# Altium schematic sheet driveII.SchDoc
size A3
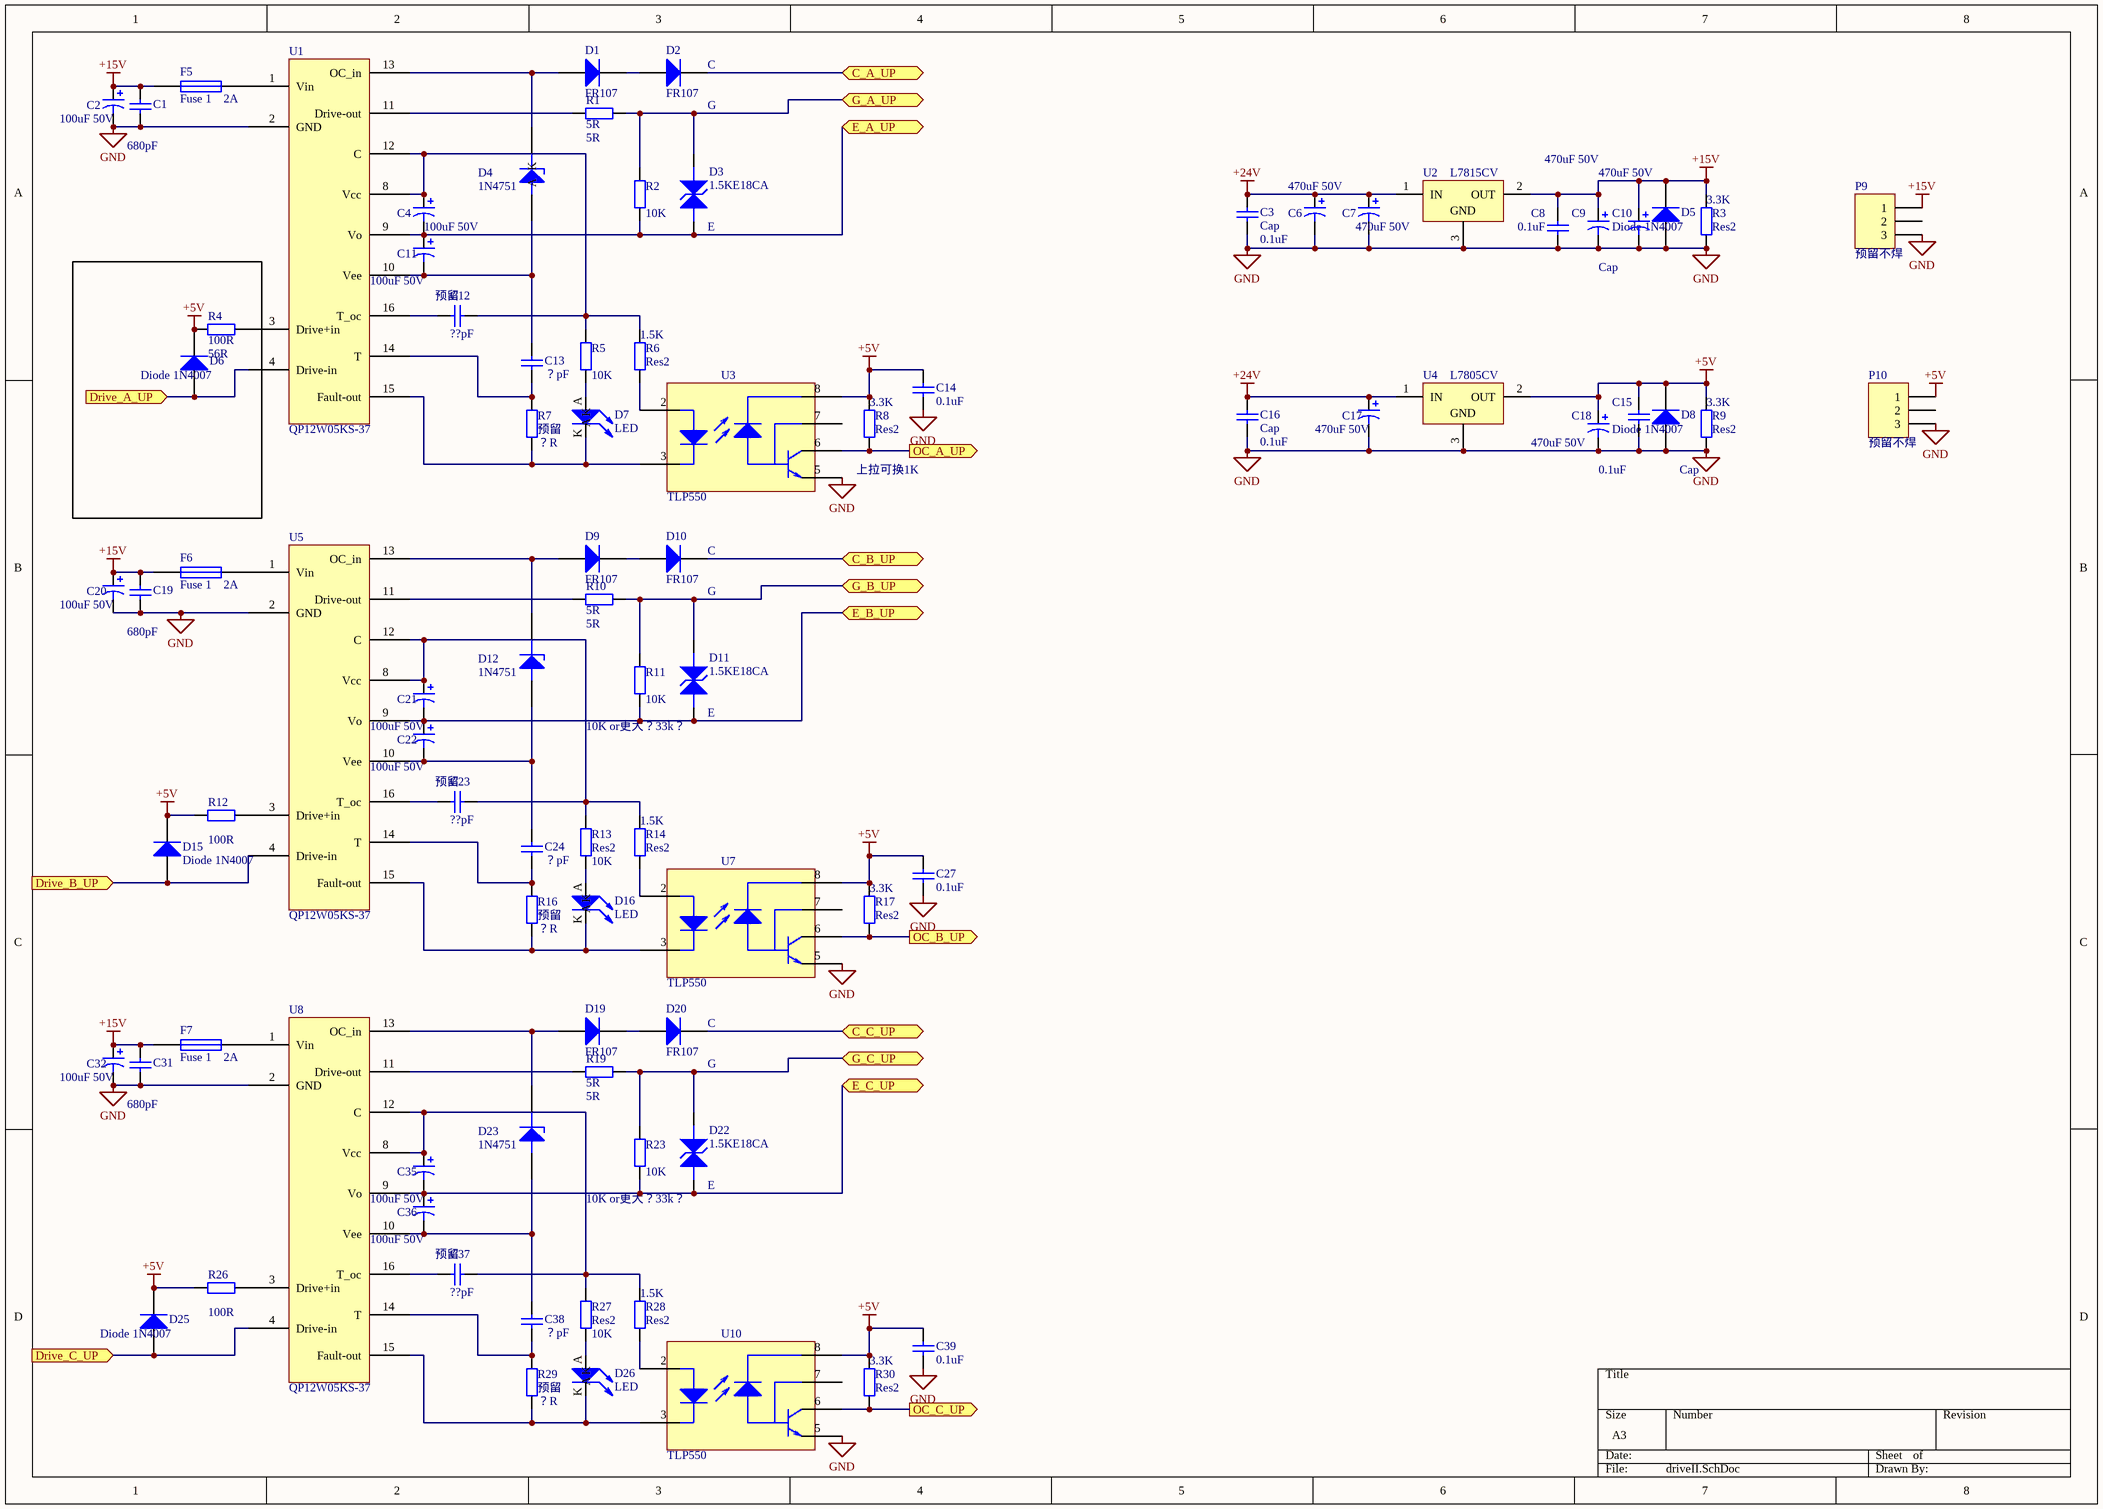
[diagram p0: driveII.SchDoc]

## Parts
C1  value 680pF  [1206]  (hidden comment: Cap)
C2  value 100uF 50V  [电解电容1000uF]  (hidden comment: Cap Pol1)
C3  Cap  value 0.1uF  [1206]
C4  value 100uF 50V  [电解电容1000uF]  (hidden comment: Cap Pol1)
C6  value 470uF 50V  [电解电容470uf]  (hidden comment: Cap Pol1)
C7  value 470uF 50V  [电解电容470uf]  (hidden comment: Cap Pol1)
C8  Cap  value 0.1uF  [1206]
C9  value 470uF 50V  [电解电容470uf]  (hidden comment: Cap Pol1)
C10  value 470uF 50V  [电解电容470uf]  (hidden comment: Cap Pol1)
C11  value 100uF 50V  [电解电容1000uF]  (hidden comment: Cap Pol1)
C12  预留  value ??pF  [1206]
C13  value ？pF  [1206]  (hidden comment: 预留)
C14  value 0.1uF  [1206]  (hidden comment: Cap)
C15  Cap  value 0.1uF  [1206]
C16  Cap  value 0.1uF  [1206]
C17  value 470uF 50V  [电解电容470uf]  (hidden comment: Cap Pol1)
C18  value 470uF 50V  [电解电容470uf]  (hidden comment: Cap Pol1)
C19  value 680pF  [1206]  (hidden comment: Cap)
C20  value 100uF 50V  [电解电容1000uF]  (hidden comment: Cap Pol1)
C21  value 100uF 50V  [电解电容1000uF]  (hidden comment: Cap Pol1)
C22  value 100uF 50V  [电解电容1000uF]  (hidden comment: Cap Pol1)
C23  预留  value ??pF  [1206]
C24  value ？pF  [1206]  (hidden comment: 预留)
C27  value 0.1uF  [1206]  (hidden comment: Cap)
C31  value 680pF  [1206]  (hidden comment: Cap)
C32  value 100uF 50V  [电解电容1000uF]  (hidden comment: Cap Pol1)
C35  value 100uF 50V  [电解电容1000uF]  (hidden comment: Cap Pol1)
C36  value 100uF 50V  [电解电容1000uF]  (hidden comment: Cap Pol1)
C37  预留  value ??pF  [1206]
C38  value ？pF  [1206]  (hidden comment: 预留)
C39  value 0.1uF  [1206]  (hidden comment: Cap)
D1  FR107  [DIODE-0.4]
D2  FR107  [DIODE-0.4]
D3  1.5KE18CA  [AXIAL0.4]
D4  1N4751  [DIODE0.4]
D5  Diode 1N4007  [DIODE0.4]
D6  Diode 1N4007  [DIODE-0.4]
D7  LED  [0805D]
D8  Diode 1N4007  [DIODE0.4]
D9  FR107  [DIODE-0.4]
D10  FR107  [DIODE-0.4]
D11  1.5KE18CA  [AXIAL0.4]
D12  1N4751  [DIODE0.4]
D15  Diode 1N4007  [DIODE-0.4]
D16  LED  [0805D]
D19  FR107  [DIODE-0.4]
D20  FR107  [DIODE-0.4]
D22  1.5KE18CA  [AXIAL0.4]
D23  1N4751  [DIODE0.4]
D25  Diode 1N4007  [DIODE-0.4]
D26  LED  [0805D]
F5  Fuse 1　2A  [CAPR5-4X5]
F6  Fuse 1　2A  [CAPR5-4X5]
F7  Fuse 1　2A  [CAPR5-4X5]
P9  预留不焊  [PHENOX-3]
P10  预留不焊  [PHENOX-3]
R1  5R  [AXIAL0.6]
R2  10K  [AXIAL0.4]
R3  Res2  value 3.3K  [AXIAL0.4]
R4  100R  value 56R  [AXIAL-0.6]
R5  value 10K  [1206]  (hidden comment: Res2)
R6  Res2  value 1.5K  [1206]
R7  预留  value ？R  [1206]
R8  Res2  value 3.3K  [1206]
R9  Res2  value 3.3K  [AXIAL0.4]
R10  5R  [AXIAL0.6]
R11  10K or更大？33k？  value 10K  [AXIAL0.4]
R12  value 100R  [AXIAL-0.6]  (hidden comment: Res2)
R13  Res2  value 10K  [1206]
R14  Res2  value 1.5K  [1206]
R16  预留  value ？R  [1206]
R17  Res2  value 3.3K  [1206]
R19  5R  [AXIAL0.6]
R23  10K or更大？33k？  value 10K  [AXIAL0.4]
R26  value 100R  [AXIAL-0.6]  (hidden comment: Res2)
R27  Res2  value 10K  [1206]
R28  Res2  value 1.5K  [1206]
R29  预留  value ？R  [1206]
R30  Res2  value 3.3K  [1206]
U1  QP12W05KS-37  [QP12W05KS37]
U2  L7815CV  [TO220ABN]
U3  TLP550  [DIP8]
U4  L7805CV  [TO220ABN]
U5  QP12W05KS-37  [QP12W05KS37]
U7  TLP550  [DIP8]
U8  QP12W05KS-37  [QP12W05KS37]
U10  TLP550  [DIP8]

## Ports
C_A_UP, C_B_UP, C_C_UP, Drive_A_UP (in), Drive_B_UP (in), Drive_C_UP (in), E_A_UP, E_B_UP, E_C_UP, G_A_UP, G_B_UP, G_C_UP, OC_A_UP (out), OC_B_UP (out), OC_C_UP (out)

## Nets
+5V: C14.1 C15.2 C18.1 C27.1 C39.1 D6.2(K) D8.K D15.2(K) D25.2(K) P10.1 R4.2 R8.2 R9.2 R12.2 R17.2 R26.2 R30.2 U3.8 U4.2(OUT) U7.8 U10.8
+15V: C1.2 C2.1 C8.2 C9.1 C10.1 C19.2 C20.1 C31.2 C32.1 D5.K F5.1 F6.1 F7.1 P9.1 R3.2 U2.2(OUT)
+24V: C3.2 C6.1 C7.1 C16.2 C17.1 U2.1(IN) U4.1(IN)
GND: C1.1 C2.2 C3.1 C6.2 C7.2 C8.1 C9.2 C10.2 C14.2 C15.1 C16.1 C17.2 C18.2 C19.1 C20.2 C27.2 C31.1 C32.2 C39.2 D5.A D8.A P9.3 P10.3 R3.1 R9.1 U1.2(GND) U2.3(GND) U3.5 U4.3(GND) U5.2(GND) U7.5 U8.2(GND) U10.5
C_A_UP: D2.2(K) ; port C_A_UP
C_B_UP: D10.2(K) ; port C_B_UP
C_C_UP: D20.2(K) ; port C_C_UP
Drive_A_UP: D6.1(A) U1.4(Drive-in) ; port Drive_A_UP
Drive_B_UP: D15.1(A) U5.4(Drive-in) ; port Drive_B_UP
Drive_C_UP: D25.1(A) U8.4(Drive-in) ; port Drive_C_UP
E_A_UP: C4.2 C11.1 D3.1 R2.1 U1.9(Vo) ; port E_A_UP
E_B_UP: C21.2 C22.1 D11.1 R11.1 U5.9(Vo) ; port E_B_UP
E_C_UP: C35.2 C36.1 D22.1 R23.1 U8.9(Vo) ; port E_C_UP
G_A_UP: D3.2 R1.2 R2.2 ; port G_A_UP
G_B_UP: D11.2 R10.2 R11.2 ; port G_B_UP
G_C_UP: D22.2 R19.2 R23.2 ; port G_C_UP
OC_A_UP: R8.1 U3.6 ; port OC_A_UP
OC_B_UP: R17.1 U7.6 ; port OC_B_UP
OC_C_UP: R30.1 U10.6 ; port OC_C_UP
NetC4_1: C4.1 C12.1 R5.2 R6.2 U1.8(Vcc) U1.12(C)
NetC11_2: C11.2 C13.1 D4.A U1.10(Vee)
NetC12_2: C12.2 U1.16(T_oc)
NetC13_2: C13.2 R7.2 U1.14(T)
NetC21_1: C21.1 C23.1 R13.2 R14.2 U5.8(Vcc) U5.12(C)
NetC22_2: C22.2 C24.1 D12.A U5.10(Vee)
NetC23_2: C23.2 U5.16(T_oc)
NetC24_2: C24.2 R16.2 U5.14(T)
NetC35_1: C35.1 C37.1 R27.2 R28.2 U8.8(Vcc) U8.12(C)
NetC36_2: C36.2 C38.1 D23.A U8.10(Vee)
NetC37_2: C37.2 U8.16(T_oc)
NetC38_2: C38.2 R29.2 U8.14(T)
NetD1_1: D1.1(A) D4.K U1.13(OC_in)
NetD1_2: D1.2(K) D2.1(A)
NetD7_A: D7.A R5.1
NetD7_K: D7.K R7.1 U1.15(Fault-out) U3.3
NetD9_1: D9.1(A) D12.K U5.13(OC_in)
NetD9_2: D9.2(K) D10.1(A)
NetD16_A: D16.A R13.1
NetD16_K: D16.K R16.1 U5.15(Fault-out) U7.3
NetD19_1: D19.1(A) D23.K U8.13(OC_in)
NetD19_2: D19.2(K) D20.1(A)
NetD26_A: D26.A R27.1
NetD26_K: D26.K R29.1 U8.15(Fault-out) U10.3
NetF5_2: F5.2 U1.1(Vin)
NetF6_2: F6.2 U5.1(Vin)
NetF7_2: F7.2 U8.1(Vin)
NetR1_1: R1.1 U1.11(Drive-out)
NetR4_1: R4.1 U1.3(Drive+in)
NetR6_1: R6.1 U3.2
NetR10_1: R10.1 U5.11(Drive-out)
NetR12_1: R12.1 U5.3(Drive+in)
NetR14_1: R14.1 U7.2
NetR19_1: R19.1 U8.11(Drive-out)
NetR26_1: R26.1 U8.3(Drive+in)
NetR28_1: R28.1 U10.2

Not connected (* = marked no-connect by the designer): P9 2; P10 2; U3 7; U7 7; U10 7

## Notes on the sheet
- (near D2) C
- G
- (near D3) E
- (near R8) 上拉可换1K
- (near D10) C
- (near D11) E
- (near D20) C
- (near D22) E

## Library data of the parts
C1 C3 C8 C13-C16 C19 C24 C27 C31 C38 C39 = Cap: Capacitor; Published: 8-Jun-2000; LatestRevisionDate: 17-Jul-2002; LatestRevisionNote: Re-released for DXP Platform.; PackageReference: RAD-0.3; Publisher: Altium Limited
C2 C4 C6 C7 C9-C11 C17 C18 C20-C22 C32 C35 C36 = Cap Pol1: Polarized Capacitor (Radial); Published: 8-Jun-2000; LatestRevisionDate: 17-Jul-2002; LatestRevisionNote: Re-released for DXP Platform.; PackageReference: RB7.6-15; Publisher: Altium Limited
C12 C23 C37 = Cap: Published: 8-Jun-2000; LatestRevisionDate: 17-Jul-2002; LatestRevisionNote: Re-released for DXP Platform.; PackageReference: RAD-0.3; Publisher: Altium Limited
D1 D2 D5 D6 D8-D10 D15 D19 D20 D25 = Diode 1N4148: High Conductance Fast Diode; Published: 8-Jun-2000; LatestRevisionDate: 17-Jul-2002; LatestRevisionNote: Re-released for DXP Platform.; DatasheetVersion: 1997; PackageReference: DO-35; Publisher: Altium Limited; Code_JEDEC: DO-204-AH; ComponentLink1Description: Manufacturer Link; ComponentLink1URL: http://www.fairchildsemi.com/; ComponentLink2Description: Datasheet; ComponentLink2URL: http://www.fairchildsemi.com/ds/1N%2F1N4148.pdf
D3 D11 D22 = D-SMBJ5.0CA: TVS 18V
D4 D12 D23 = ZENER1: Zener Diode 30V
D7 D16 D26 = DIODE1
F5-F7 = Fuse 1: Fuse; Published: 8-Jun-2000; LatestRevisionDate: 17-Jul-2002; LatestRevisionNote: Re-released for DXP Platform.; PackageReference: PIN-W2/E2.8; Publisher: Altium Limited
P9 P10 = Header 3: Header, 3-Pin; LatestRevisionDate: 17-Jul-2002; LatestRevisionNote: Re-released for DXP Platform.; Publisher: Altium Limited
R1-R14 R16 R17 R19 R23 R26-R30 = Res2: Resistor; Published: 8-Jun-2000; LatestRevisionDate: 17-Jul-2002; LatestRevisionNote: Re-released for DXP Platform.; PackageReference: AXIAL-0.4; Publisher: Altium Limited
  R1 R10 R19: Value: 5R
  R2: Value: 10K
U2 U4 = L7815CV: Positive Voltage Regulator; Note: Tab is connected to pin 3 (GND).; Published: 24-Aug-2001; LatestRevisionDate: 17-Jul-2002; LatestRevisionNote: Re-released for DXP Platform.; DatasheetVersion: Dec-1998; PackageVersion: Jun-1998; PackageReference: TO220ABN; Publisher: Altium Limited; PackageDescription: TO, Thru-Hole, Vertical, Heatsink Mounted; 3 In-Line Leads; Pitch 2.54 mm; Pin sequence 1, 3, 2; ComponentLink1Description: Manufacturer Link; ComponentLink1URL: http://www.st.com/
U3 U7 U10 = HCPL4053